# EAGLE design IOmodule-8x_fused_35x25_fm (EAGLE 9.6.2)
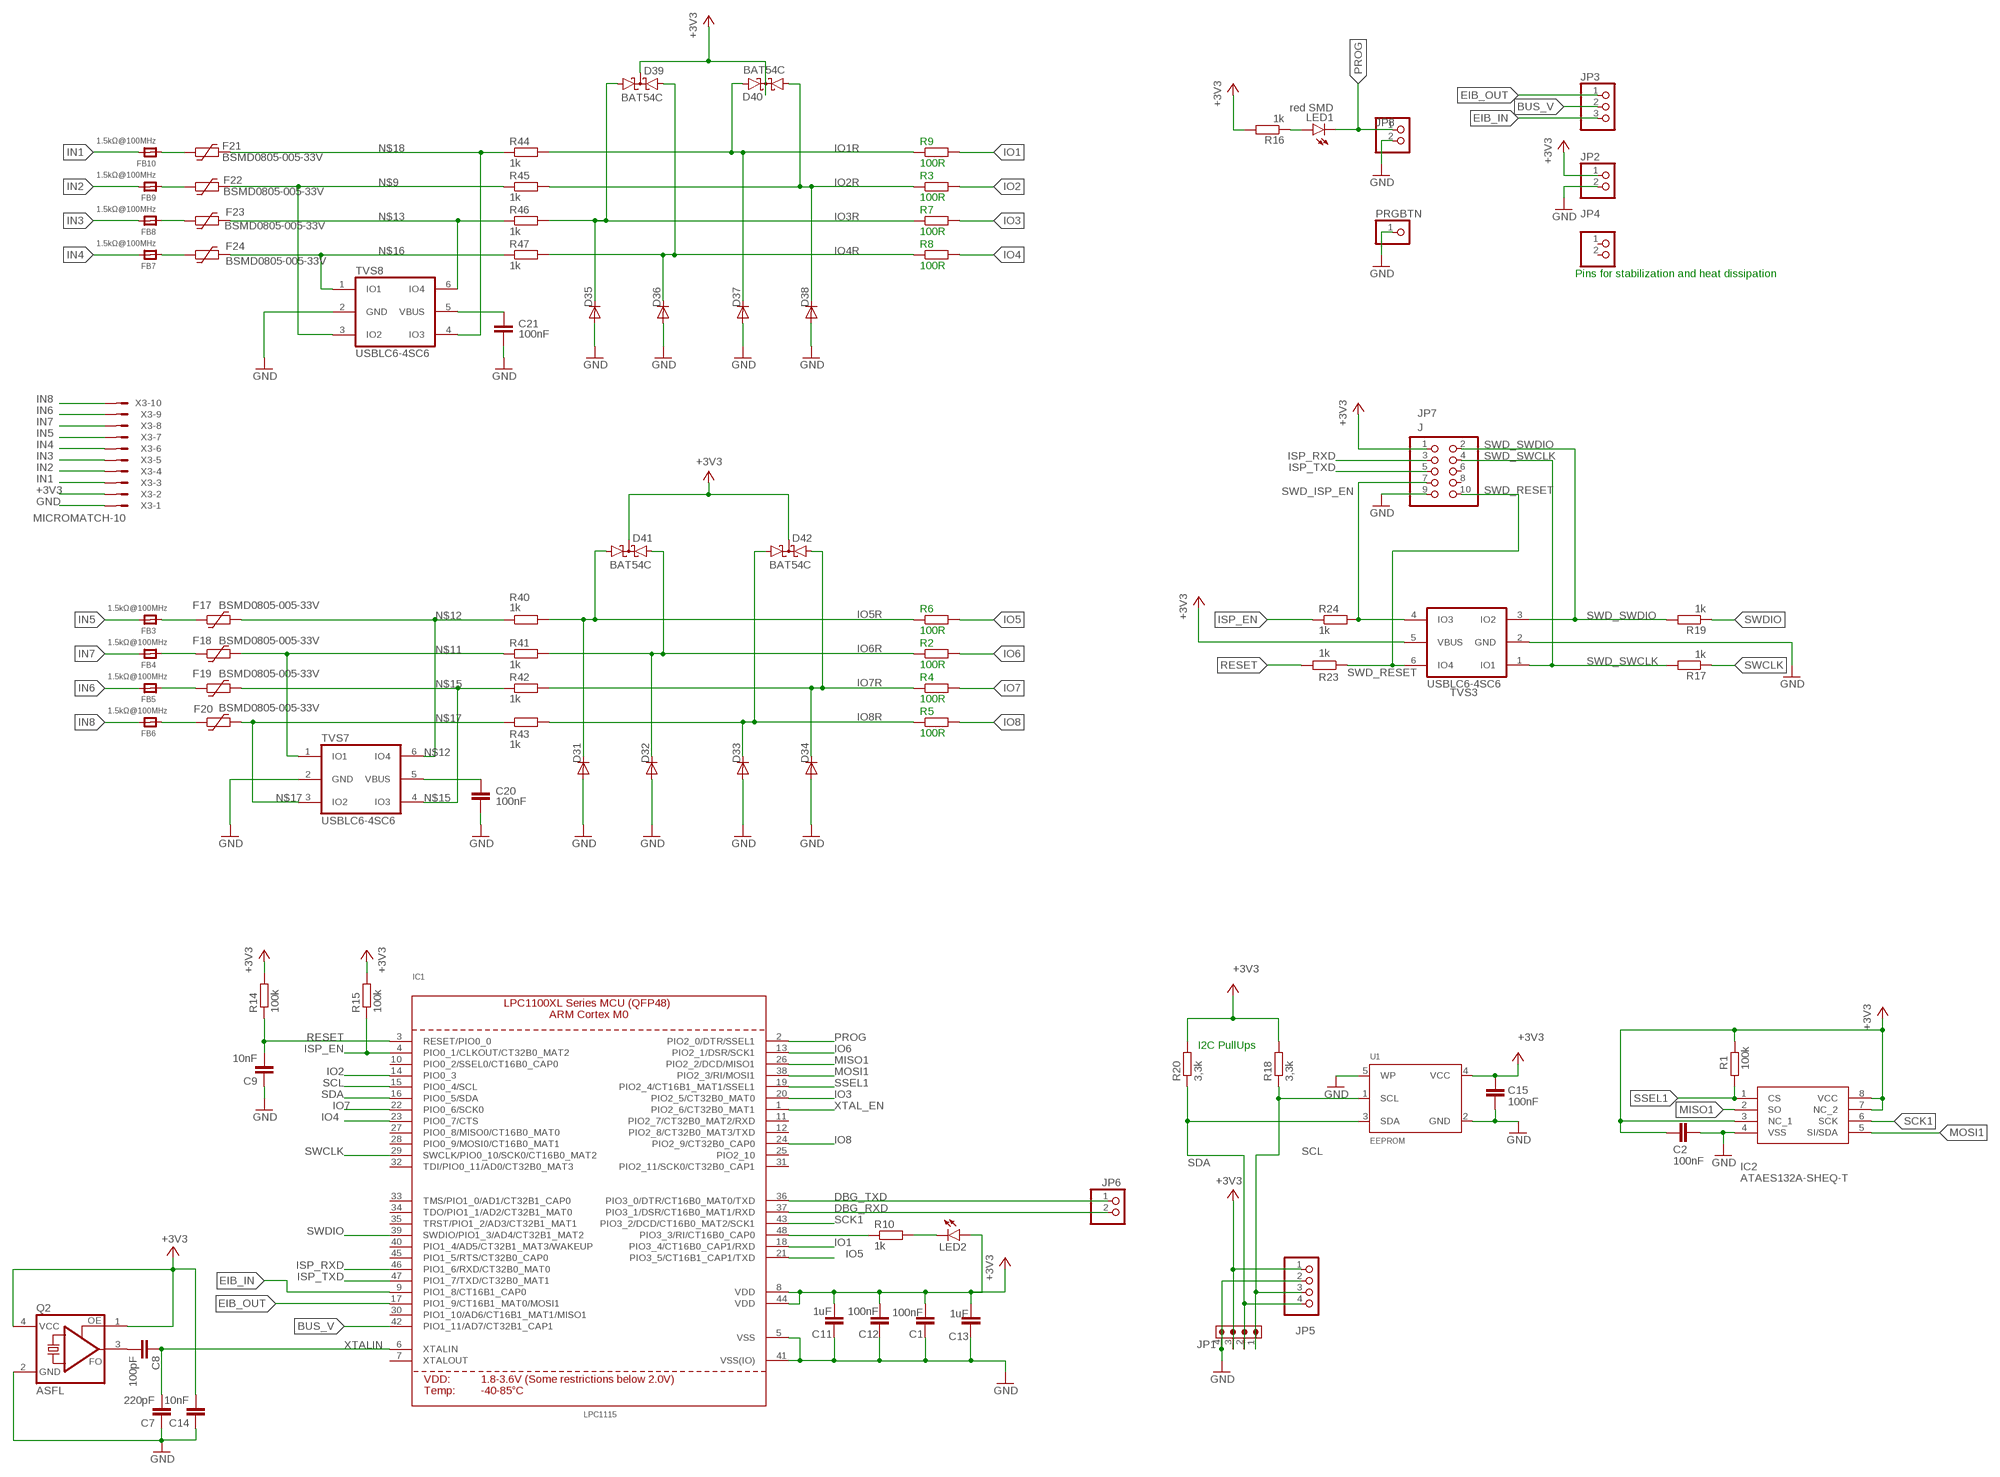
[diagram p0: schematic, sheet 1]

## Parts
C1  100nF  C-EUC0805  [C0805]
C2  100nF  C-EUC0805  [C0805]
C7  220pF  C-EUC0805  [C0805]
C8  100pF  C-EUC0805  [C0805]
C9  10nF  C-EUC0805  [C0805]
C11  1uF  C-EUC0805  [C0805]
C12  100nF  C-EUC0805  [C0805]
C13  1uF  C-EUC0805  [C0805]
C14  10nF  C-EUC0805  [C0805]
C15  100nF  C-EUC0805  [C0805]
C20  100nF  C-EUC0805  [C0805]
C21  100nF  C-EUC0805  [C0805]
D31  DDZ9684  DIODESOD-123  [SOD-123]
D32  DDZ9684  DIODESOD-123  [SOD-123]
D33  DDZ9684  DIODESOD-123  [SOD-123]
D34  DDZ9684  DIODESOD-123  [SOD-123]
D35  DDZ9684  DIODESOD-123  [SOD-123]
D36  DDZ9684  DIODESOD-123  [SOD-123]
D37  DDZ9684  DIODESOD-123  [SOD-123]
D38  DDZ9684  DIODESOD-123  [SOD-123]
D39  BAT54C  [SOT23]
D40  BAT54C  [SOT23]
D41  BAT54C  [SOT23]
D42  BAT54C  [SOT23]
F17  BSMD0805-005-33V  0805L035  [0805L]
F18  BSMD0805-005-33V  0805L035  [0805L]
F19  BSMD0805-005-33V  0805L035  [0805L]
F20  BSMD0805-005-33V  0805L035  [0805L]
F21  BSMD0805-005-33V  0805L035  [0805L]
F22  BSMD0805-005-33V  0805L035  [0805L]
F23  BSMD0805-005-33V  0805L035  [0805L]
F24  BSMD0805-005-33V  0805L035  [0805L]
FB3  1.5kΩ@100MHz  FERRITE0805  [0805]
FB4  1.5kΩ@100MHz  FERRITE0805  [0805]
FB5  1.5kΩ@100MHz  FERRITE0805  [0805]
FB6  1.5kΩ@100MHz  FERRITE0805  [0805]
FB7  1.5kΩ@100MHz  FERRITE0805  [0805]
FB8  1.5kΩ@100MHz  FERRITE0805  [0805]
FB9  1.5kΩ@100MHz  FERRITE0805  [0805]
FB10  1.5kΩ@100MHz  FERRITE0805  [0805]
IC1  LPC1115  LPC1113/4/5_QFP48_XLSERIES  [LQFP48]
IC2  ATAES132A-SHEQ-T  [SOIC127P600X175-8N]
JP1  62000411622  62000411622  [62000411622]
JP2  PINHD-1X2  [1X02]
JP3  PINHD-1X3  [1X03]
JP4  PINHD-1X2  [1X02]
JP5  PINHD-1X4  [1X04]
JP6  PINHD-1X2  [1X02]
JP7  J  PINHD-2X05_2.00  [2X05M]
JP8  PINHD-1X2  [1X02]
LED1  red SMD  LEDCHIPLED_0805  [CHIPLED_0805]
LED2  LEDCHIPLED_0805  [CHIPLED_0805]
PRGBTN  PINHD-1X1  [1X01]
Q2  ASFL  [ASF]
R1  100k  R-EU_R0805  [R0805]
R2  100R  R-EU_R0805  [R0805]
R3  100R  R-EU_R0805  [R0805]
R4  100R  R-EU_R0805  [R0805]
R5  100R  R-EU_R0805  [R0805]
R6  100R  R-EU_R0805  [R0805]
R7  100R  R-EU_R0805  [R0805]
R8  100R  R-EU_R0805  [R0805]
R9  100R  R-EU_R0805  [R0805]
R10  1k  R-EU_R0805  [R0805]
R14  100k  R-EU_R0805  [R0805]
R15  100k  R-EU_R0805  [R0805]
R16  1k  R-EU_R0805  [R0805]
R17  1k  R-EU_R0805  [R0805]
R18  3,3k  R-EU_R0805  [R0805]
R19  1k  R-EU_R0805  [R0805]
R20  3,3k  R-EU_R0805  [R0805]
R23  1k  R-EU_R0805  [R0805]
R24  1k  R-EU_R0805  [R0805]
R40  1k  R-EU_R0805  [R0805]
R41  1k  R-EU_R0805  [R0805]
R42  1k  R-EU_R0805  [R0805]
R43  1k  R-EU_R0805  [R0805]
R44  1k  R-EU_R0805  [R0805]
R45  1k  R-EU_R0805  [R0805]
R46  1k  R-EU_R0805  [R0805]
R47  1k  R-EU_R0805  [R0805]
TVS3  USBLC6-4SC6  [SOT-23-6L]
TVS7  USBLC6-4SC6  [SOT-23-6L]
TVS8  USBLC6-4SC6  [SOT-23-6L]
U1  EEPROM  EEPROM_I2C_MCP24AA32  [SOT23-5]
X3  MICROMATCH-10  [MICROMATCH-10]

## Nets
+3V3: C1.2 C2.1 C11.2 C12.2 C13.2 C14.2 C15.1 D39.3(CC) D40.3(CC) D41.3(CC) D42.3(CC) IC1.8(VDD) IC1.44(VDD) IC2.3(NC_1) IC2.7(NC_2) IC2.8(VCC) JP1.3 JP2.1 JP5.1 JP7.1 LED2.A Q2.1(OE) Q2.4(VCC) R1.2 R14.2 R15.2 R16.2 R18.2 R20.2 TVS3.5(VBUS) U1.4(VCC) X3.2
BUS_V: IC1.42(PIO1_11/AD7/CT32B1_CAP1) JP3.2
DBG_RXD: IC1.37(PIO3_1/DSR/CT16B0_MAT1/RXD) JP6.2
DBG_TXD: IC1.36(PIO3_0/DTR/CT16B0_MAT0/TXD) JP6.1
EIB_IN: IC1.9(PIO1_8/CT16B1_CAP0) JP3.3
EIB_OUT: IC1.17(PIO1_9/CT16B1_MAT0/MOSI1) JP3.1
GND: C1.1 C2.2 C7.1 C9.1 C11.1 C12.1 C13.1 C14.1 C15.2 C20.1 C21.1 D31.A D32.A D33.A D34.A D35.A D36.A D37.A D38.A IC1.5(VSS) IC1.41(VSS(IO)) IC2.4(VSS) JP1.4 JP2.2 JP5.2 JP7.9 JP8.2 PRGBTN.1 Q2.2(GND) TVS3.2(GND) TVS7.2(GND) TVS8.2(GND) U1.2(GND) U1.5(WP) X3.1
IN1: FB10.2 X3.3
IN2: FB9.2 X3.4
IN3: FB8.2 X3.5
IN4: FB7.2 X3.6
IN5: FB3.2 X3.7
IN6: FB5.2 X3.9
IN7: FB4.2 X3.8
IN8: FB6.2 X3.10
IO1: IC1.18(PIO3_4/CT16B0_CAP1/RXD) R9.2
IO1R: D37.C D40.2(A2) R9.1 R44.2
IO2: IC1.14(PIO0_3) R3.2
IO2R: D38.C D40.1(A1) R3.1 R45.2
IO3: IC1.20(PIO2_5/CT32B0_MAT0) R7.2
IO3R: D35.C D39.1(A1) R7.1 R46.2
IO4: IC1.23(PIO0_7/CTS) R8.2
IO4R: D36.C D39.2(A2) R8.1 R47.2
IO5: IC1.21(PIO3_5/CT16B1_CAP1/TXD) R6.2
IO5R: D31.C D41.1(A1) R6.1 R40.2
IO6: IC1.13(PIO2_1/DSR/SCK1) R2.2
IO6R: D32.C D41.2(A2) R2.1 R41.2
IO7: IC1.22(PIO0_6/SCK0) R4.2
IO7R: D34.C D42.2(A2) R4.1 R42.2
IO8: IC1.24(PIO2_9/CT32B0_CAP0) R5.2
IO8R: D33.C D42.1(A1) R5.1 R43.2
ISP_EN: IC1.4(PIO0_1/CLKOUT/CT32B0_MAT2) R15.1 R24.1
ISP_RXD: IC1.46(PIO1_6/RXD/CT32B0_MAT0) JP7.3
ISP_TXD: IC1.47(PIO1_7/TXD/CT32B0_MAT1) JP7.5
MISO1: IC1.26(PIO2_2/DCD/MISO1) IC2.2(SO)
MOSI1: IC1.38(PIO2_3/RI/MOSI1) IC2.5(SI/SDA)
N$1: F19.1 FB5.1
N$2: F20.1 FB6.1
N$3: F18.1 FB4.1
N$4: F17.1 FB3.1
N$5: F24.1 FB7.1
N$6: F23.1 FB8.1
N$7: F21.1 FB10.1
N$8: F22.1 FB9.1
N$9: F22.2 R45.1 TVS8.3(IO2)
N$10: C8.2 Q2.3(FO)
N$11: F18.2 R41.1 TVS7.1(IO1)
N$12: F17.2 R40.1 TVS7.6(IO4)
N$13: F23.2 R46.1 TVS8.6(IO4)
N$14: LED2.C R10.2
N$15: F19.2 R42.1 TVS7.4(IO3)
N$16: F24.2 R47.1 TVS8.1(IO1)
N$17: F20.2 R43.1 TVS7.3(IO2)
N$18: F21.2 R44.1 TVS8.4(IO3)
N$19: IC1.48(PIO3_3/RI/CT16B0_CAP0) R10.1
N$41: LED1.A R16.1
N$43: C20.2 TVS7.5(VBUS)
N$48: C21.2 TVS8.5(VBUS)
PROG: IC1.2(PIO2_0/DTR/SSEL1) JP8.1 LED1.C
RESET: C9.2 IC1.3(RESET/PIO0_0) R14.1 R23.2
SCK1: IC1.43(PIO3_2/DCD/CT16B0_MAT2/SCK1) IC2.6(SCK)
SCL: IC1.15(PIO0_4/SCL) JP1.1 JP5.3 R18.1 U1.1(SCL)
SDA: IC1.16(PIO0_5/SDA) JP1.2 JP5.4 R20.1 U1.3(SDA)
SSEL1: IC1.19(PIO2_4/CT16B1_MAT1/SSEL1) IC2.1(CS) R1.1
SWCLK: IC1.29(SWCLK/PIO0_10/SCK0/CT16B0_MAT2) R17.1
SWD_ISP_EN: JP7.7 R24.2 TVS3.4(IO3)
SWD_RESET: JP7.10 R23.1 TVS3.6(IO4)
SWD_SWCLK: JP7.4 R17.2 TVS3.1(IO1)
SWD_SWDIO: JP7.2 R19.2 TVS3.3(IO2)
SWDIO: IC1.39(SWDIO/PIO1_3/AD4/CT32B1_MAT2) R19.1
XTAL_EN: IC1.1(PIO2_6/CT32B0_MAT1)
XTALIN: C7.2 C8.1 IC1.6(XTALIN)
Unconnected: IC1.7(XTALOUT) IC1.10(PIO0_2/SSEL0/CT16B0_CAP0) IC1.11(PIO2_7/CT32B0_MAT2/RXD) IC1.12(PIO2_8/CT32B0_MAT3/TXD) IC1.25(PIO2_10) IC1.27(PIO0_8/MISO0/CT16B0_MAT0) IC1.28(PIO0_9/MOSI0/CT16B0_MAT1) IC1.30(PIO1_10/AD6/CT16B1_MAT1/MISO1) IC1.31(PIO2_11/SCK0/CT32B0_CAP1) IC1.32(TDI/PIO0_11/AD0/CT32B0_MAT3) IC1.33(TMS/PIO1_0/AD1/CT32B1_CAP0) IC1.34(TDO/PIO1_1/AD2/CT32B1_MAT0) IC1.35(TRST/PIO1_2/AD3/CT32B1_MAT1) IC1.40(PIO1_4/AD5/CT32B1_MAT3/WAKEUP) IC1.45(PIO1_5/RTS/CT32B0_CAP0) JP4.1 JP4.2 JP7.6 JP7.8

## Notes on the sheet
- Pins for stabilization and heat dissipation
- I2C PullUps

## Library data of the parts
C1 C2 C7-C9 C11-C15 C20 C21 = rcl:C-EU: CAPACITOR, European symbol; SPICEPREFIX: C
D31-D38 = microbuilder:DIODE: Diode SMA Model Volts Amps Type Vf Vr Digikey # Notes SSA34-E3 40V 3A Schottky 480mV @ 3A 200uA @ 40V SSA34-E3/61TGITR-ND CDBA120-G 20V 1A Schottky 500mV @ 1A 500uA @ 20V 641-1014-6-ND REEL MBRA210 10V 2A Schottky 350mV @ 2A 700uA @ 10V MBRA210LT3 SOD-123 Model Volts Amps Type Vf Vr Order # Notes BAT54T1G 30V 200mA Schottky 800mV @ 200mA 2uA @ 25V BAT54T1GOSTR-ND B0530W 30V 500mA Schottky 430mV @ 500mA 130uA @ 30V B0530W-FDICT-ND REEL MBR120 1A 20V Schottky 340mV @ 1A MBR120VLSFT1GOSCT-ND SOD-323 Model Volts Amps Type Vf Vr Order # Notes PMEG2005EJ 20V 500mA Schottky 355mV @ 500mA 568-4110-1-ND ZLLS410 10V 570mA Schottky 380mV @ 570mA ZLLS410CT-ND 1N4148WS 75V 150mA Silicon/Simple 1V 1N4148WSFSCT-ND REEL SOD-523 Model Volts Amps Type Vf Vr Order # Notes BAT54XV2 30V 200mA Schottky 0.8V @ 100mA BAT54XV2CT-ND TB751S 30V 30mA Schottky RB751S-40TE61CT-ND SOT23-R/W (R = Solder Paste/Reflow Ovens, W = Hand-Soldering) Model Volts Amps Type Vf Vr Order # Notes BAT54FILM 40V 300mA Schottky 497-7162-1-ND
D39-D42 = diode:BAT54C: Schottky Diodes Source: Fairchild .. BAT54.pdf
F17-F24 = polyfuse-smd_10:?: Polyfuse Resettable PTC Source: http://www.littelfuse.com/products/resettable-ptcs.aspx; MF: Littelfuse; MPN: 0805L035; OC_FARNELL: 1832102RL; OC_NEWARK: 18M4775
FB3-FB10 = microbuilder:FERRITE: Ferrite Bead 0603 MMZ1608B121C - 120 Ohm @ 100MHz, 600mA, 0.15 Ohm DC Resistance - Digikey: 445-2164-1-ND BK1608HW121-T - 120 Ohm, 600mA Ferrite Chip - Digikey: 587-1876-2-ND 0805 HZ0805B272R-10 - 2.7K Ohm @ 100MHz, 200mA, 0.8 Ohm DC Resistance - Digikey: 240-2504-1-ND (see also Murata BLM21BD272SN1L) MMZ2012Y152B - 1.5K Ohm @ 100MHz, 500mA, 0.4 Ohm DC Resistance - Digikey: 445-1560-1-ND - Mainly for high frequency (80-400MHz) MMZ2012R102A - 1K Ohm @ 100MHz, 500mA, 0.3 Ohm DC Resistance - Digikey: 445-1555-2-ND - More general purpose (10-200MHz)
IC1 = microbuilder:LPC1113/4/5_QFP48_XLSERIES: LPC1113/4/5 ARM Cortex M0 MCU (50MHz) - XL Series (FBD48/3x3) LPC1115FBD48/303: Max Frequency: 50MHz Flash: 64kB SRAM: 8kB ADC: 10-bit
IC2 = SamacSys_Parts:ATAES132A-SHEQ-T: Security ICs / Authentication ICs 32Kbit AES Auth SPI soic(S), GR Source: Datasheet <http://www.microchip.com/mymicrochip/filehandler.aspx?ddocname=en590569>; DESCRIPTION: Security ICs / Authentication ICs 32Kbit AES Auth SPI soic(S), GR; HEIGHT: 1.75mm; MANUFACTURER_NAME: Microchip; MANUFACTURER_PART_NUMBER: ATAES132A-SHEQ-T; MOUSER_PART_NUMBER: 556-ATAES132A-SHEQ-T; MOUSER_PRICE-STOCK: https://www.mouser.co.uk/ProductDetail/Microchip-Technology-Atmel/ATAES132A-SHEQ-T?qs=9KdFJXLqUo%252BeCVGZWjCBZQ%3D%3D
JP1 = Eagle_WR-WTB (rev22a):62000411622: WR-WTB 2.00 mm Male Vertical Shrouded Header KIND PROPERTIES: Pitch 2 mm Gender Male Type Vertical MATERIAL PROPERTIES: Insulator Material LCP Insulator Flammability Rating UL94 V-0 Insulator Color Beige; White Contact Material Copper Alloy Contact Plating Tin Contact Type Stamped GENERAL INFORMATION Operating Temperature -25 up to +85 °C IR 2 A Working Voltage 125 V (AC) Withstanding Voltage 800 V (AC) Contact Resistance 20 mΩ RISO 1000 MΩ CERTIFICATION UL Approval E323964 PACKAGING PROPERTIES Packaging Bag <https://www.we-online.com/catalog/media/o33351v209%20Family_WR-WTB_6200xx11622.jpg> Details see: www.we-online.com/catalog/WTB_2_00_MALE_VERTICAL_SHROUDED_HEADER_6200XX11622 <www.we-online.com/catalog/WTB_2_00_MALE_VERTICAL_SHROUDED_HEADER_6200XX11622/?utm_source=eagle_model&utm_medium=description_link&utm_campaign=eisos_eagle> Updated by Ella Wu 2022-07-27 2022 (C) Würth Elektronik; CONTACT-RESISTANCE: 20mOhm; DATASHEET-URL: https://www.we-online.com/redexpert/spec/62000411622?ae; GENDER: Male; IR: 2A; L: 10mm; MOUNT: THT; PACKAGING: Bag; PART-NUMBER: 62000411622; PCB-CABLE-PANEL: PCB; PINS: 4; PITCH: 2mm; TYPE: Vertical; WORKING-VOLTAGE: 125V(AC)
JP2 JP4 JP6 JP8 = pinhead_dmx:PINHD-1X2: PIN HEADER
JP3 = pinhead_dmx:PINHD-1X3: PIN HEADER
JP5 = pinhead_dmx:PINHD-1X4: PIN HEADER
JP7 = pinhead-2:PINHD-2X05: PIN HEADER; REICHELT: MPE 150-3-010
LED1 LED2 = led:LED: LED OSRAM: - CHIPLED LG R971, LG N971, LY N971, LG Q971, LY Q971, LO R971, LY R971 LH N974, LH R974 LS Q976, LO Q976, LY Q976 LO Q996 - Hyper CHIPLED LW Q18S LB Q993, LB Q99A, LB R99A - SideLED LS A670, LO A670, LY A670, LG A670, LP A670 LB A673, LV A673, LT A673, LW A673 LH A674 LY A675 LS A676, LA A676, LO A676, LY A676, LW A676 LS A679, LY A679, LG A679 - Hyper Micro SIDELED® LS Y876, LA Y876, LO Y876, LY Y876 LT Y87S - SmartLED LW L88C, LW L88S LB L89C, LB L89S, LG L890 LS L89K, LO L89K, LY L89K LS L896, LA L896, LO L896, LY L896 - TOPLED LS T670, LO T670, LY T670, LG T670, LP T670 LSG T670, LSP T670, LSY T670, LOP T670, LYG T670 LG T671, LOG T671, LSG T671 LB T673, LV T673, LT T673, LW T673 LH T674 LS T676, LA T676, LO T676, LY T676, LB T676, LH T676, LSB T676, LW T676 LB T67C, LV T67C, LT T67C, LS T67K, LO T67K, LY T67K, LW E67C LS E67B, LA E67B, LO E67B, LY E67B, LB E67C, LV E67C, LT E67C LW T67C LS T679, LY T679, LG T679 LS T770, LO T770, LY T770, LG T770, LP T770 LB T773, LV T773, LT T773, LW T773 LH T774 LS E675, LA E675, LY E675, LS T675 LS T776, LA T776, LO T776, LY T776, LB T776 LHGB T686 LT T68C, LB T68C - Hyper Mini TOPLED® LB M676 - Mini TOPLED Santana® LG M470 LS M47K, LO M47K, LY M47K Source: http://www.osram.convergy.de LUXEON: - LUMILED® LXK2-PW12-R00, LXK2-PW12-S00, LXK2-PW14-U00, LXK2-PW14-V00 LXK2-PM12-R00, LXK2-PM12-S00, LXK2-PM14-U00 LXK2-PE12-Q00, LXK2-PE12-R00, LXK2-PE12-S00, LXK2-PE14-T00, LXK2-PE14-U00 LXK2-PB12-K00, LXK2-PB12-L00, LXK2-PB12-M00, LXK2-PB14-N00, LXK2-PB14-P00, LXK2-PB14-Q00 LXK2-PR12-L00, LXK2-PR12-M00, LXK2-PR14-Q00, LXK2-PR14-R00 LXK2-PD12-Q00, LXK2-PD12-R00, LXK2-PD12-S00 LXK2-PH12-R00, LXK2-PH12-S00 LXK2-PL12-P00, LXK2-PL12-Q00, LXK2-PL12-R00 Source: www.luxeon.com KINGBRIGHT: KA-3528ASYC Source: www.kingbright.com
PRGBTN = pinhead_dmx:PINHD-1X1: PIN HEADER
Q2 = crystal:ASF*: CRYSTAL CLOCK OSCILLATORS 5.0 Vdc or 3.3 Vdc - LOW PROFILE ULTRA MINIATURE CERAMIC SURFACE MOUNT Source: http://www.abracon.com/Oscillators/asf1-L-L1.pdf; MPN: ASFLM1-50.000MHZ-C-T; OC_FARNELL: 1838931; OC_NEWARK: 99M0411
R1-R10 R14-R20 R23 R24 R40-R47 = rcl:R-EU_: RESISTOR, European symbol; SPICEPREFIX: R
TVS3 TVS7 TVS8 = usblc6:USBLC6-4: Very low capacitance ESD protection 4 line Features 4 data-line protection Protects V BUS Very low capacitance: 3 pF Very low leakage current: 10 nA Peak pulse power (8/20 μs): 130 W typ. SOT23-6L package RoHS compliant Datasheet <https://www.st.com/resource/en/datasheet/usblc6-4.pdf>
U1 = microbuilder:EEPROM_I2C_MCP24AA32: Microchip 32K (4K x 8) 1.8V I2C EEPROM SOT23-5 [Digikey: 24AA32AFT-I/OTCT-ND]
X3 = con-amp-micromatch:MICROMATCH-10: MicroMaTch 10 8-215464-0 / 1-215464-0 Drawing Number C-215464 DDEController.pdf; MF: FARNELL; MPN: 8-215464-0; OC_FARNELL: 3784654; OC_NEWARK: 19J6430

## Board
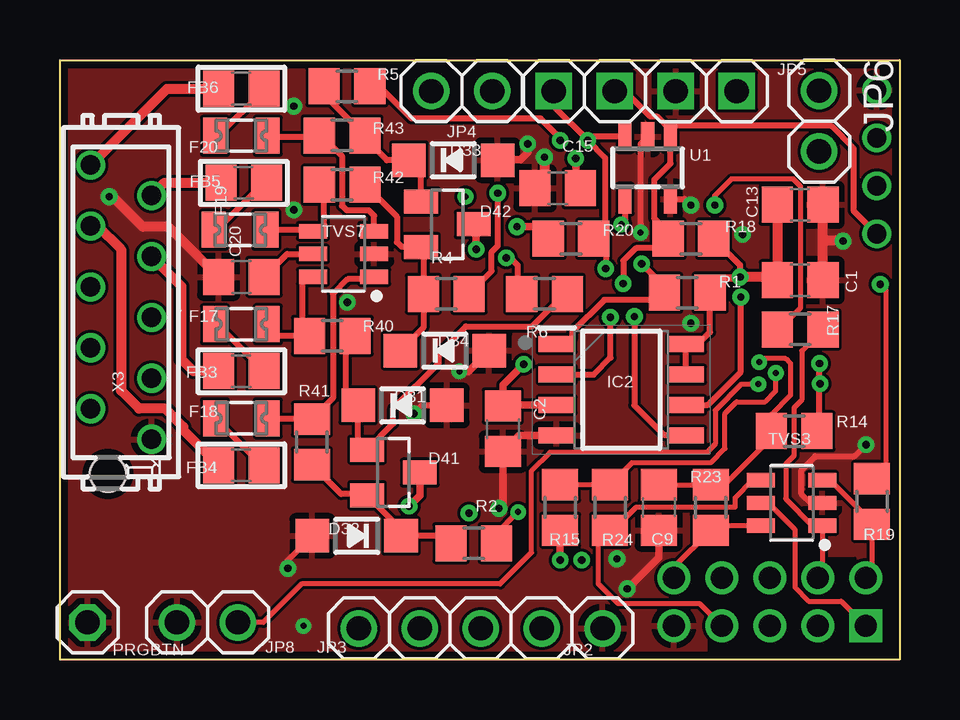
[diagram p1: board, top side]
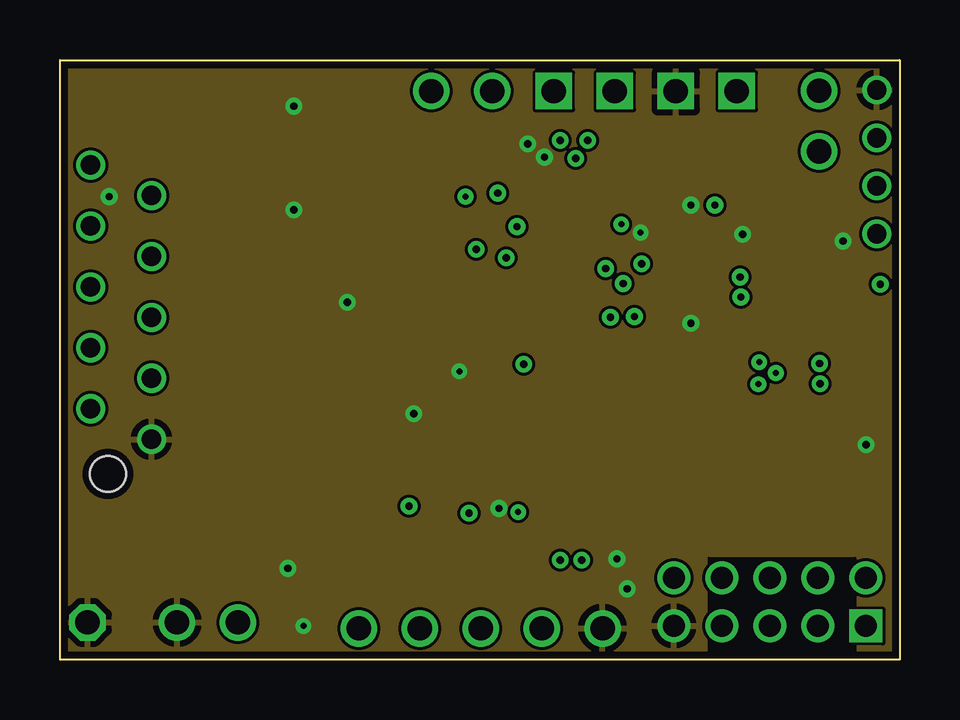
[diagram p2: board, inner layer GND]
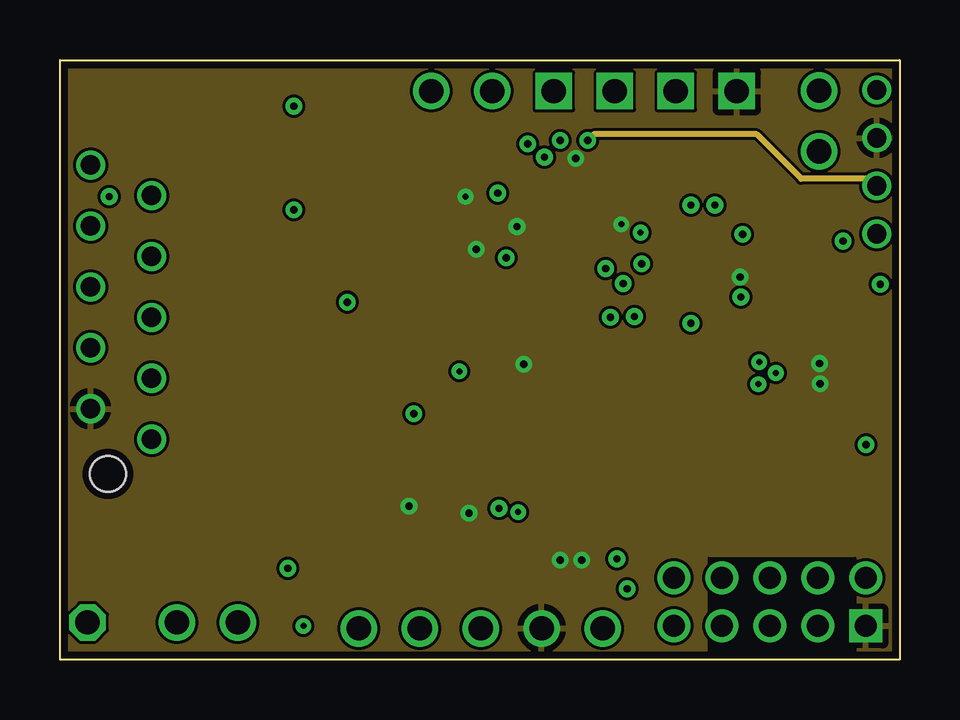
[diagram p3: board, inner layer VCC]
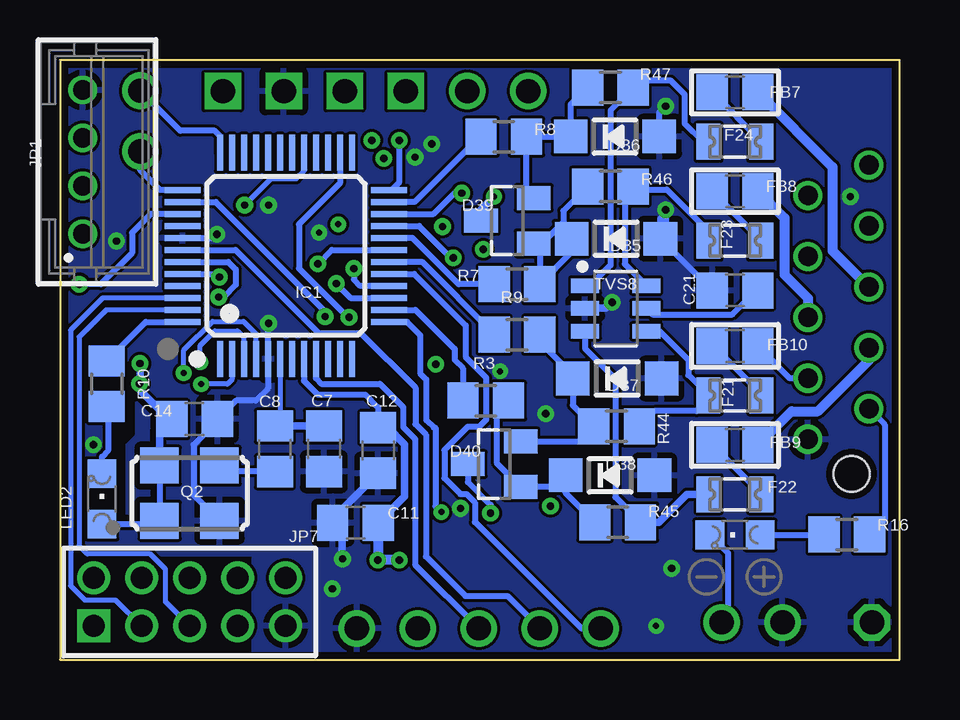
[diagram p4: board, bottom side, seen from below]

Size 35 x 25 mm. Coordinates in mm from the lower left corner, seen from the top.
Outline: 35,0 0,0 0,25 35,25 35,0
Copper layers (1+2*15+16): Top 0.035mm / dielectric 0.2mm / GND 0.018mm / dielectric 1.5mm / VCC 0.018mm / dielectric 0.2mm / Bottom 0.035mm
Design rules "aisler_4_layer_complex *": minimum track width 0.125mm, minimum drill 0.2mm, track to track 0.125mm, track to pad 0.125mm, pad to pad 0.125mm, via to via 0.125mm, smd to smd 0.125mm, copper to edge 0.3mm, drill to drill 0.25mm, minimum pad ring 0.2mm, minimum via ring 0.2mm, stop-mask expansion 0mil, vias tented up to drill 0mil, thermal gap 10mil

### Footprints (pad centres in the part's own frame; a part is rotated, then mirrored left to right if it is on the bottom)
C0805 = smd 1.3 x 1.5: 1 -0.95,0; 2 0.95,0
SOD-123 = smd 1.4 x 1.4: A 1.85,0; C -1.85,0
SOT23 = smd 1 x 1.4: 1 -0.95,-1.1; 2 0.95,-1.1; 3 0,1.1
0805L = smd 1 x 1.5: 1 -1.1,0; 2 1.1,0
0805 = smd 1.3 x 1.5: 1 -0.95,0; 2 0.95,0
LQFP48 = smd 1.5 x 0.25: 1 -4.3,2.75; 2 -4.3,2.25; 3 -4.3,1.75; 4 -4.3,1.25; 5 -4.3,0.75; 6 -4.3,0.25; 7 -4.3,-0.25; 8 -4.3,-0.75; 9 -4.3,-1.25; 10 -4.3,-1.75; 11 -4.3,-2.25; 12 -4.3,-2.75; 25 4.3,-2.75; 26 4.3,-2.25; 27 4.3,-1.75; 28 4.3,-1.25; 29 4.3,-0.75; 30 4.3,-0.25; 31 4.3,0.25; 32 4.3,0.75; 33 4.3,1.25; 34 4.3,1.75; 35 4.3,2.25; 36 4.3,2.75 | smd 0.25 x 1.5: 13 -2.75,-4.3; 14 -2.25,-4.3; 15 -1.75,-4.3; 16 -1.25,-4.3; 17 -0.75,-4.3; 18 -0.25,-4.3; 19 0.25,-4.3; 20 0.75,-4.3; 21 1.25,-4.3; 22 1.75,-4.3; 23 2.25,-4.3; 24 2.75,-4.3; 37 2.75,4.3; 38 2.25,4.3; 39 1.75,4.3; 40 1.25,4.3; 41 0.75,4.3; 42 0.25,4.3; 43 -0.25,4.3; 44 -0.75,4.3; 45 -1.25,4.3; 46 -1.75,4.3; 47 -2.25,4.3; 48 -2.75,4.3
SOIC127P600X175-8N = smd 1.5 x 0.65: 1 -2.7,1.905; 2 -2.7,0.635; 3 -2.7,-0.635; 4 -2.7,-1.905; 5 2.7,-1.905; 6 2.7,-0.635; 7 2.7,0.635; 8 2.7,1.905
62000411622 = drill 0.8: 1 3,-0.6; 2 1,-0.6; 3 -1,-0.6; 4 -3,-0.6
1X02 = drill 1.016: 1 -1.27,0; 2 1.27,0
1X03 = drill 1.016: 1 -2.54,0; 2 0,0; 3 2.54,0
1X04 = drill 1.016 square: 1 -3.81,0; 2 -1.27,0; 3 1.27,0; 4 3.81,0
2X05M = drill 0.914 square: 1 -4,-1 | drill 0.914: 2 -4,1; 3 -2,-1; 4 -2,1; 5 0,-1; 6 0,1; 7 2,-1; 8 2,1; 9 4,-1; 10 4,1
CHIPLED_0805 = smd 1.2 x 1.2: A 0,-1.05; C 0,1.05
1X01 = drill 1.016 octagon: 1 0,0
ASF = smd 1.6 x 1.5: 1 -1.25,-1.15; 2 1.25,-1.15; 3 1.25,1.15; 4 -1.25,1.15
R0805 = smd 1.3 x 1.5: 1 -0.95,0; 2 0.95,0
SOT-23-6L = smd 1.165 x 0.597: 1 -1.275,0.95; 2 -1.275,0; 3 -1.275,-0.95; 4 1.275,-0.95; 5 1.275,0; 6 1.275,0.95
SOT23-5 = smd 0.55 x 1.2: 1 -0.95,-1.3; 2 0,-1.3; 3 0.95,-1.3; 4 0.95,1.3; 5 -0.95,1.3
MICROMATCH-10 = drill 0.813: 1 5.715,1.27; 2 4.445,-1.27; 3 3.175,1.27; 4 1.905,-1.27; 5 0.635,1.27; 6 -0.635,-1.27; 7 -1.905,1.27; 8 -3.175,-1.27; 9 -4.445,1.27; 10 -5.715,-1.27 | hole 1.5: 7.16,-0.55

### Placement (x,y rotation side)
C1  30.86,15.82 180 top
C2  18.46,9.62 270 top
C7  23.99,8.79 90 bottom
C8  26.04,8.79 270 bottom
C9  24.97,6.34 90 top
C11  22.68,5.71 0 bottom
C12  21.73,8.72 90 bottom
C13  30.86,18.96 180 top
C14  29.39,10.03 180 bottom
C15  20.75,19.65 180 top
C20  7.56,15.95 0 top
C21  6.86,15.39 0 bottom
D31  14.28,10.6 0 top
D32  12.37,5.16 180 top
D33  16.39,20.82 0 top
D34  16.05,12.88 0 top
D35  11.82,17.55 0 bottom
D36  11.86,21.81 0 bottom
D37  11.77,11.72 0 bottom
D38  12.07,7.68 0 bottom
D39  16.35,18.3 90 bottom
D40  16.9,8.15 90 bottom
D41  13.9,7.8 270 top
D42  16.15,18.15 270 top
F17  7.56,13.98 0 top
F18  7.56,10.06 0 top
F19  7.51,17.92 0 top
F20  7.56,21.84 0 top
F21  6.86,11.01 180 bottom
F22  6.86,6.89 180 bottom
F23  6.86,17.46 180 bottom
F24  6.86,21.59 180 bottom
FB3  7.56,12.02 180 top
FB4  7.56,8.1 180 top
FB5  7.66,19.88 180 top
FB6  7.56,23.8 180 top
FB7  6.86,23.65 0 bottom
FB8  6.86,19.53 0 bottom
FB9  6.86,8.95 0 bottom
FB10  6.86,13.07 0 bottom
IC1  25.58,16.83 90 bottom
IC2  23.4,11.25 0 top
JP1  33.45,20.75 270 bottom
JP2  21.35,1.3 0 top
JP3  15,1.3 0 top
JP4  16.75,23.7 180 top
JP5  24.4,23.7 180 top
JP6  31.65,22.45 270 top
JP7  29.6,2.4 0 bottom
JP8  6.15,1.55 180 top
LED1  6.86,5.2 90 bottom
LED2  33.25,6.7 0 bottom
PRGBTN  1.15,1.55 0 top
Q2  29.6,6.94 0 bottom
R1  26.15,15.3 0 top
R2  17.25,4.85 0 top
R3  17.25,10.8 180 bottom
R4  16.1,15.25 0 top
R5  11.96,23.9 0 top
R6  20.2,15.25 180 top
R7  15.95,15.65 180 bottom
R8  16.5,21.8 180 bottom
R9  15.95,13.55 180 bottom
R10  33.05,11.5 270 bottom
R14  30.6,9.53 0 top
R15  20.85,6.34 270 top
R16  2.2,5.21 0 bottom
R17  30.86,13.77 0 top
R18  26.3,17.55 0 top
R19  33.85,6.59 270 top
R20  21.3,17.55 180 top
R23  27.13,6.34 90 top
R24  22.93,6.34 270 top
R40  11.35,13.5 0 top
R41  10.5,9.07 270 top
R42  11.76,19.8 0 top
R43  11.76,21.85 0 top
R44  11.8,9.72 180 bottom
R45  11.75,5.72 180 bottom
R46  12.05,19.73 180 bottom
R47  12.05,23.85 180 bottom
TVS3  30.5,6.53 180 top
TVS7  11.82,16.91 180 top
TVS8  11.83,14.64 0 bottom
U1  24.5,20.5 180 top
X3  2.55,14.9 270 top

### Tracks (layer width: path | path; a pad name or v marks a point on that pad's centre or on a via)
+3V3  (via drill 0.25, 0.3)
  Top 0.2: TVS3.5 29.53,6.53 30.64,5.43 30.64,3 31.2,2.44 32.56,2.44 JP7.1
  Top 0.254: R1.2 27.1,13.65 26.6,13.15 IC2.8 IC2.7 | R14.2 31.66,9.64 v31.66,12.35 | U1.4 23.55,18.3 v23.4,18.15 | R18.2 28.35,16.45 v28.35,15.95
  Top 0.305: R20.2 19.85,18.05 v19.05,18.05 | C15.1 21.5,19.85 v21.5,20.9 | v28.35,15.95 28.3,15.9 27.7,15.9 R1.2 | D41.3 15,6.85 v14.55,6.4 | D42.3 17.35,18.05 v17.35,17.1 | R15.2 | R15.2 v20.85,4.15 | IC2.3 18.51,10.62 C2.1 18.46,11.45 v19.34,12.31
  Top 0.406: C13.2 C1.2 29.77,15.95 v28.35,15.95
  Bottom 0.254: Q2.4 Q2.1 30.85,5.65 LED2.A | IC1.8 24.83,11.62 24.26,11.05 22.26,11.05 21.73,10.52 C12.2 | IC1.44 28.48,16.08 v28.35,15.95 | X3.2 0.62,9.8 0.62,5.84 R16.2 | D40.3 18,7.4 17.05,6.45 v17.05,6.1
  Bottom 0.305: Q2.4 30.85,9.52 C14.2 30.39,9.98 30.43,9.98 31.66,11.21 v31.66,12.35 | C12.2 21.33,9.67 20.63,8.97 20.63,6.8 C11.2 21.75,5.69 | v16.91,19.3 17.45,18.76 D39.3
  Bottom 0.406: 21.75,5.69 v21.75,4.15 v20.85,4.15
  other vias: 31.69,11.5
  pour VCC (rank 3): 0,25 0,0 35,0 35,25
BUS_V
  Bottom 0.254: JP3.2 16.35,2.65 18.1,2.65 19.75,4.3 19.75,9.38 20.19,9.82 20.19,11.35 22.46,13.62 24.22,13.62 27.68,17.08 IC1.42
DBG_RXD
  Bottom 0.254: IC1.37 30.83,19.58 31.65,20.4 JP6.2
DBG_TXD
  Bottom 0.254: IC1.36 28.33,21.83 28.55,22.05 29.98,22.05 JP6.1
EIB_IN
  Bottom 0.254: IC1.9 24.33,11.73 24.1,11.5 21.67,11.5 20.69,10.53 20.69,9.7 20.19,9.2 20.19,3.95 JP3.3
EIB_OUT
  Bottom 0.254: IC1.17 20.23,16.08 18.09,13.94 18.09,12.62 17.23,11.76 17.23,9.99 17.52,9.7 18,9.7 18.97,8.73 18.97,7.57 18.31,6.9 18.05,6.9 17.7,6.55 17.7,5.74 13.26,1.3 JP3.1
GND  (via drill 0.25, 0.3)
  Top 0.254: D32.A 9.5,4.14 v9.5,3.8 | v33.6,8.96 33.11,8.47 31.49,8.47 30.91,7.89 30.91,6.92 31.35,6.48 31.73,6.48 TVS3.2 | D31.A 15.1,10.6 v14.75,10.25 | D33.A 18.27,20.85 18.82,20.85 | U1.2 24.2,21.5 v24.2,17.8 | U1.5 26.05,19.2 v26.3,18.95
  Top 0.305: v19.5,21.5 19.5,21.15 19.2,20.85 18.82,20.85 | D34.A 17.03,12.02 v16.65,12.02 | v23.65,2.95 24.97,4.27 C9.1 | IC2.4 19.14,9.35 C2.2 18.46,6.46 v18.3,6.3
  Top 0.406: C15.2 20.2,20.05 v20.2,20.95 | v2.05,19.3 2.2,19.3 3.45,18.05 4.51,18.05 C20.1 | 31.47,18.63 C13.1 31.81,17.5 | C1.1 31.81,17.5 | 31.81,17.5 32.6,17.5 v32.65,17.45
  Bottom 0.254: IC1.41 28.61,17.58 v28.46,17.73 | Q2.2 29.43,6.87 29.43,8.95 28.43,9.95 C14.1 27.67,10.8 26.84,10.8 26.33,11.31 IC1.5 26.33,13.99 v26.3,14.02 | D36.A 10.02,22.8 v9.75,23.07 | D35.A 9.97,18.38 9.75,18.6 v9.75,18.75 9.75,17.33 C21.1
  Bottom 0.305: C12.1 23.63,5.87 C11.1 23.23,5.31 23.23,4.22 v23.21,4.2 | TVS8.2 13.1,14.65 12.23,14.65 v11.98,14.9
  other vias: 10.15,1.4
  pour GND (rank 4): 35,0 0,0 0,25 35,25
  pour Top: 0,25 0,0 35,0 35,25
  pour Bottom (rank 3): 0,25 0,0 35,0 35,25
  pour Bottom: 26.9,11.15 31.4,11.15 31.85,10.7 31.85,9.35 32.25,8.95 32.25,5.15 31.75,4.65 27.25,4.65 26.7,5.2 26.7,6.3 26.35,6.65 23.25,6.65 22.85,7.05 22.85,10.45 23.15,10.75 26.5,10.75
IN1
  Bottom 0.254: X3.3 4.56,11.72 FB10.2
IN2
  Bottom 0.406: FB9.2 4.51,10.35 3.41,10.35 1.28,12.48 X3.4
IN3
  Bottom 0.406: FB8.2 4.8,18.41 4.8,16.05 3.82,15.06 X3.5
IN4
  Bottom 0.406: FB7.2 2.8,20.53 2.8,17.05 X3.6
IN5
  Top 0.406: X3.7 5.07,15.56 5.07,12.51 5.56,12.02 FB3.2
IN6
  Top 0.406: X3.9 4.35,19.88 FB5.2
IN7
  Top 0.406: FB4.2 5.14,9.58 5.14,9.71 4.38,10.46 3.3,10.46 2.55,11.21 2.55,17.11 1.58,18.07 X3.8
IN8
  Top 0.406: X3.10 4.46,23.8 FB6.2
IO1
  Bottom 0.254: IC1.18 19.91,16.59 16.9,13.57 R9.2
IO1R
  Bottom 0.254: R9.1 15,13.25 13.62,11.87 D37.C 13.62,10.6 R44.2 13.38,9.1 D40.2
IO2
  Bottom 0.254: IC1.14 20.18,14.58 18.55,12.95 18.55,12.5 18.2,12.15 R3.2
IO2R
  Bottom 0.254: R45.2 13.92,6.95 D38.C 14.4,7.2 D40.1 16.8,8.2 16.8,10.3 R3.1
IO3
  Bottom 0.254: R7.2 18.38,15.65 20.31,17.58 IC1.20
IO3R
  Bottom 0.254: D35.C 13.67,16.98 R7.1 15,17.1 D39.1 14.9,17.35 14.02,18.23 14.02,18.71 R46.2
IO4
  Bottom 0.254: R8.2 17.5,21.8 20.22,19.08 IC1.23
IO4R
  Bottom 0.254: R47.2 13.71,23.14 D36.C 13.72,21.8 R8.1 15.55,19.55 D39.2
IO5  (via drill 0.3)
  Top 0.254: v18.6,16.75 18.68,16.84 19.08,16.44 19.08,15.42 R6.2
  Bottom 0.254: IC1.21 20.03,18.08 18.7,16.75 v18.6,16.75
IO5R
  Top 0.254: R6.1 21.05,15.25 19.68,13.89 16.92,13.89 15.79,12.76 15.79,12.37 13.89,10.47 13.89,9.84 D41.1 12.43,9.12 D31.C 11.9,11.13 11.9,13.1 R40.2
IO6  (via drill 0.25)
  Top 0.254: v19.1,6.15 18.15,5.2 18.15,4.9 R2.2
  Bottom 0.254: IC1.13 20.53,14.08 19.98,13.53 19.98,11.93 19.73,11.68 19.73,9.98 19.42,9.67 19.35,9.67 19.35,6.4 v19.1,6.15
IO6R
  Top 0.254: R41.2 11.72,6.9 12.75,6.9 D41.2 14.22,5.43 D32.C 15.99,5.16 R2.1
IO7  (via drill 0.3)
  Top 0.254: v18.25,19.44 18.25,17.25 18,17 18,16.2 R4.2
  Bottom 0.254: IC1.22 19.42,18.58 18.56,19.44 v18.25,19.44
IO7R
  Top 0.254: R42.2 14.05,18.46 14.05,17.4 14.25,17.2 D42.2 15.15,17.1 R4.1 15.15,13.84 D34.C
IO8  (via drill 0.3)
  Top 0.254: R5.2 13.31,23.9 14.65,22.56 20.04,22.56 20.85,21.75 v20.85,21.65
  Bottom 0.254: IC1.24 21.18,19.58 20.85,19.91 v20.85,21.65
IO8R
  Top 0.254: R5.1 11.01,23.55 R43.2 12.71,21.74 13.63,20.82 D33.C 15.05,20.32 D42.1
ISP_EN  (via drill 0.25)
  Top 0.2: R15.1 R24.1 23.84,8.2 27.13,8.2 27.72,8.79 27.72,10.27 28.2,10.75 29.4,10.75 29.84,11.19 v29.84,11.95
  Bottom 0.2: IC1.4 26.83,13.58 27.35,14.1 28.64,14.1 29.84,12.9 v29.84,11.95
ISP_RXD
  Bottom 0.2: IC1.46 33.22,15.08 34.56,13.74 34.56,3.07 33.98,2.49 32.69,2.49 JP7.3
ISP_TXD
  Bottom 0.2: JP7.5 30.6,2.4 30.6,3.77 31.23,4.4 33.86,4.4 34.2,4.74 34.2,13.45 33.07,14.58 IC1.47
MISO1  (via drill 0.3)
  Top 0.254: IC2.2 22.25,11.88 22.95,12.59 v22.95,14.27
  Bottom 0.254: v22.95,14.27 23,14.27 25.04,16.31 25.04,18.15 23.33,19.86 IC1.26
MOSI1  (via drill 0.3)
  Top 0.254: IC2.5 25.2,9.35 23.94,10.6 v23.94,14.3
  Bottom 0.254: v23.94,14.3 23.94,14.51 28.51,19.08 IC1.38
N$1
  Top 0.254: FB5.1 8.51,19.88 6.55,17.92 F19.1
N$2
  Top 0.254: FB6.1 8.51,23.75 6.6,21.84 F20.1
N$3
  Top 0.254: F18.1 8.42,8.1 FB4.1
N$4
  Top 0.254: F17.1 6.55,13.98 FB3.1
N$5
  Bottom 0.254: F24.1 FB7.1
N$6
  Bottom 0.254: FB8.1 7.81,19.51 F23.1
N$7
  Bottom 0.254: FB10.1 7.76,13.07 5.76,11.07 F21.1
N$8
  Bottom 0.254: FB9.1 F22.1
N$9
  Bottom 0.254: TVS8.3 13.11,12.96 11.85,11.7 11.85,6.77 R45.1
  Bottom 0.305: R45.1 10.04,5.72 8.87,6.89 F22.2
N$10
  Bottom 0.254: Q2.3 28.35,8.04 28.15,7.83 C8.2
N$11
  Top 0.254: TVS7.1 12.99,15.86 11.99,15.86 11.38,15.24 11.38,10.9 R41.1 10.46,10.06 F18.2
N$12
  Top 0.254: F17.2 9.14,13.5 R40.1 10.1,13.5 10.1,15.71 10.35,15.96 TVS7.6
N$13
  Bottom 0.254: TVS8.6 11.46,16.49 11.46,19.37 R46.1 10.91,19.92 10.6,19.6 9.7,19.6 7.96,17.86 F23.2
N$14
  Bottom 0.254: LED2.C 33.25,8.46 33,8.71 33,10.5 R10.2
N$15
  Top 0.254: R42.1 10.93,19.8 10.99,19.73 10.99,18.06 10.79,17.86 TVS7.4 10.49,17.92 F19.2
N$16
  Bottom 0.254: F24.2 8.2,21.59 8.96,22.35 8.96,23.57 9.54,24.15 10.9,24.15 11.1,23.95 R47.1 12.05,22.9 12.05,16.45 12.9,15.59 TVS8.1
N$17
  Top 0.254: F20.2 8.7,21.8 10.76,21.8 R43.1 10.9,21.85 11.75,21 11.75,18.93 11.96,18.72 12.88,18.72 13.1,18.51 TVS7.3
N$18
  Bottom 0.254: TVS8.4 10.01,13.69 8.81,12.49 8.81,11.86 F21.2 7.96,10.86 8.46,10.36 10.21,10.36 R44.1
N$19
  Bottom 0.254: R10.1 31.42,14.08 IC1.48
N$41
  Bottom 0.254: LED1.A R16.1
N$43
  Top 0.254: C20.2 9.47,16.91 TVS7.5
N$48
  Bottom 0.254: TVS8.5 10.3,14.39 6.96,14.39 5.96,15.39 C21.2
NOGND
  cutout Top: 27.05,0 27.05,4.25 33.15,4.25 33.15,0
  cutout GND: 27.05,0 27.05,4.25 33.15,4.25 33.15,0
  cutout VCC: 27.05,0 27.05,4.25 33.15,4.25 33.15,0
  cutout VCC: 27.05,0 27.05,4.25 33.15,4.25 33.15,0
  cutout GND: 27.05,0 27.05,4.25 33.15,4.25 33.15,0
  cutout Bottom: 27.05,0 27.05,4.25 33.15,4.25 33.15,0
  cutout VCC: 27.05,0 27.05,4.25 33.15,4.25 33.15,0
  pour Bottom (isolate 0.254, rank 2): 26.9,11.15 31.4,11.15 31.85,10.7 31.85,9.35 32.25,8.95 32.25,5.15 31.75,4.65 27.25,4.65 26.7,5.2 26.7,6.3 26.35,6.65 23.25,6.65 22.85,7.05 22.85,10.45 23.15,10.75 26.5,10.75
PROG  (via drill 0.25)
  Top 0.2: v29.11,11.49 28.41,11.49 27.31,10.39 27.31,8.99 26.96,8.64 20.42,8.64 19.66,7.88 19.66,4.46 18.35,3.15 10.07,3.15 8.47,1.55 JP8.1
  Bottom 0.2: IC1.2 27.83,11.67 28.01,11.49 v29.11,11.49
  Bottom 0.254: LED1.C 7.15,4.44 7.15,1.82 JP8.1
RESET  (via drill 0.25)
  Top 0.2: v29.15,12.4 29.3,12.55 30.25,12.55 30.45,12.35 30.45,11.03 29.65,10.22 R14.1 29.65,9.24 27.7,7.29 R23.2 C9.2
  Bottom 0.2: v29.15,12.4 29.15,13.1 28.55,13.7 27.6,13.7 27.33,13.43 IC1.3
SCK1  (via drill 0.3)
  Top 0.254: IC2.6 27,10.62 28.39,12 v28.39,15.12
  Bottom 0.254: IC1.43 27.98,16.58 27.67,16.27 27.67,15.63 28.18,15.12 v28.39,15.12
SCL  (via drill 0.3)
  Top 0.254: v23.48,15.67 23.48,16.63 24,17.15 24.95,17.15 R18.1 25.35,17.82 24.77,18.4 24.77,20 25.45,20.68 U1.1 | JP5.3 23.55,23.7 24.6,22.65 24.88,22.65 25.45,22.08 U1.1 | JP1.1 33.08,18.72 33.08,21.32 32.15,22.25 25.7,22.25 25.45,22 U1.1
  Bottom 0.254: IC1.15 22.89,15.08 v23.48,15.67
SDA  (via drill 0.3)
  Top 0.254: v22.75,16.3 22.75,17.05 R20.1 22.72,18.02 22.72,20.93 v22,21.65 | JP5.4 20.59,23.06 v22,21.65 | U1.3 22.15,21.8 v22,21.65
  VCC 0.254: JP1.2 34,19.75 33.7,20.05 30.9,20.05 29.05,21.9 22.25,21.9 v22,21.65
  Bottom 0.254: v22.75,16.3 22.75,15.85 22.48,15.58 IC1.16
SSEL1  (via drill 0.3)
  Top 0.254: IC2.1 21.1,13.15 21.35,13.4 21.35,13.65 22.7,15 24.9,15 R1.1 25.2,15.55 v24.25,16.5
  Bottom 0.254: v24.25,16.5 23.67,17.08 IC1.19
SWCLK  (via drill 0.3)
  Top 0.2: R17.1 29.97,13.77 30.87,14.67 30.87,19.74 30.56,20.05 28,20.05 27.3,19.35 v27.3,18.95
  Bottom 0.2: IC1.29 24.83,20.37 25.15,20.05 26.2,20.05 v27.3,18.95
SWD_ISP_EN
  Top 0.2: JP7.7 26.66,2.34 23.26,2.34 22.43,3.17 22.43,4.89 R24.2 23.05,5.39 24.01,6.35 28.14,6.35 28.14,6.75 28.87,7.48 TVS3.4
SWD_RESET
  Top 0.2: JP7.10 25.6,3.86 R23.1 27.32,5.58 TVS3.6
SWD_SWCLK
  Top 0.2: R17.2 30.92,12.88 30.92,10.82 30.6,10.5 30.6,8.5 30.25,8.15 30.25,6.7 31.37,5.58 TVS3.1 31.77,3.58 JP7.4
SWD_SWDIO
  Top 0.2: TVS3.3 32.1,7.48 33.85,5.73 R19.2 33.85,3.65 JP7.2
SWDIO  (via drill 0.3)
  Top 0.2: v34.2,15.65 34.42,15.43 34.42,8.01 33.95,7.54 R19.1
  Bottom 0.254: IC1.39 31.22,18.58 32,17.8 32,16.95 33.3,15.65 v34.2,15.65
XTALIN
  Bottom 0.2: C8.1 25.83,9.95 IC1.6
  Bottom 0.305: C7.2 C8.1

### Text on the board
tDocu: SDA | SCL | GND | +3V3 | www.selfbus.org | selfbus.org | IO module fused 8x / v1.0.0 rc3 | GND | EIB OUT | BUS-V | EIB IN | +3V3
bDocu: (beta) | www.selfbus.org | 26.04.2022 | EIB OUT | BUS-V | EIB IN | +3V3 | GND